# Altium schematic sheet Thermal Control.SchDoc
size A; SheetNumber: 10; SheetTotal: 16
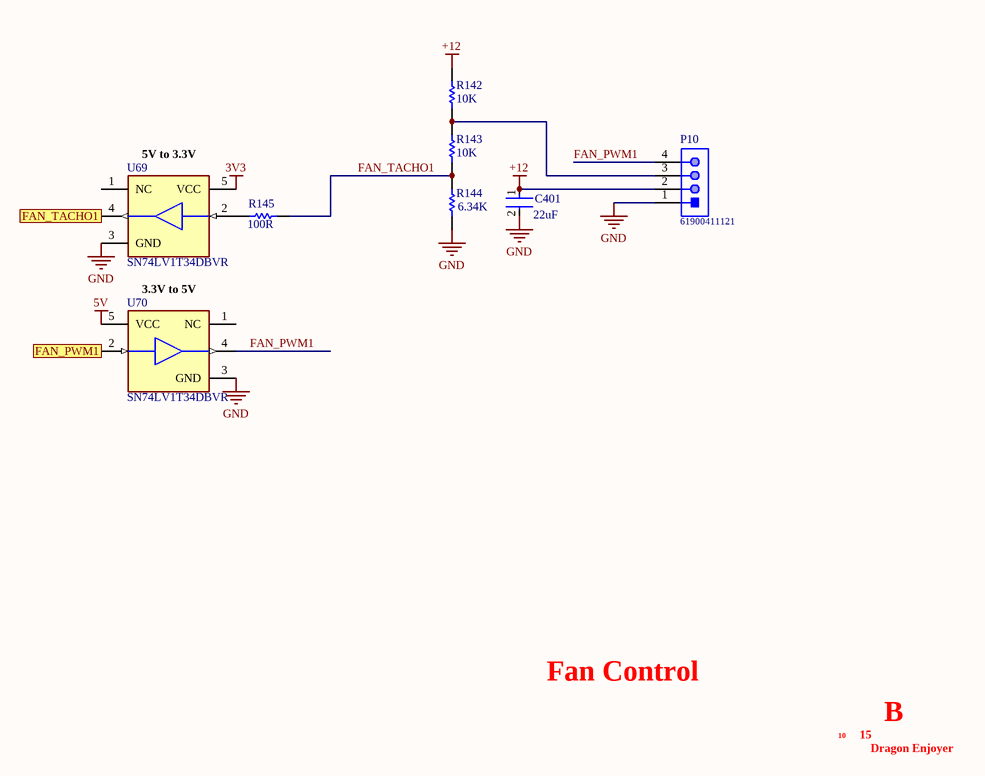
[diagram p0: Thermal Control.SchDoc]

## Parts
C401  value 22uF  [FP-CL31H-0_2-MFG]  (hidden comment: CL31A226KAHNNNE)
P10  61900411121  [61900411121]
R142  10K  [RESC1005X40X25NL05T05]
R143  10K  [RESC1005X40X25NL05T05]
R144  value 6.34K  [RESC1608X55X30ML15T15]  (hidden comment: ERJ-3EKF6341V)
R145  value 100R  [RESC1609X50X30ML8T20]  (hidden comment: CRCW0603100RFKEA)
U69  SN74LV1T34DBVR  [FP-DBV0005A-MFG]
U70  SN74LV1T34DBVR  [FP-DBV0005A-MFG]

## Ports
FAN_PWM1 (in), FAN_TACHO1 (out)

## Nets
3V3: U69.5(VCC)
5V: U70.5(VCC)
+12: C401.1 P10.2 R142.2
GND: C401.2 P10.1 R144.1 U69.3(GND) U70.3(GND)
FAN_PWM1: U70.2(A) ; port FAN_PWM1
FAN_PWM1: P10.4 U70.4(Y)  [a separate net that carries the same name]
FAN_TACHO1: U69.4(Y) ; port FAN_TACHO1
FAN_TACHO1: R143.1 R144.2 R145.2  [a separate net that carries the same name]
NetP10_3: P10.3 R142.1 R143.2
NetR145_1: R145.1 U69.2(A)

Not connected (* = marked no-connect by the designer): U69 1(NC); U70 1(NC)

## Notes on the sheet
- (near U69) 5V to 3.3V
- 3.3V to 5V
- Fan Control
- 10
- 15
- B
- Dragon Enjoyer

## Library data of the parts
C401 = CMP-13271-000012-1: CAP CER 22UF 25V X5R 1206; Manufacturer: Samsung; Temperature Coefficient: 15%; Tolerance: 10%; Material: Ceramic; Automotive: No; Device Class L3: Ceramic Capacitors; Temperature: -55°C to +85°C; Octopart: https://octopart.com/cl31a226kahnnne-samsung-19832795; Temperature Range Low: -55°C; Voltage Rating: 25V; Height: 1.8mm; Temperature Characteristic: X5R; Package: CL31H-0.2; Temperature Range High: +85°C; ComponentLink2URL: http://www.samsungsem.com/kr/support/product-search/mlcc/__icsFiles/afieldfile/2019/05/10/19-CL31A226KAHNNNE.pdf; Ipc Land Pattern Name: CAPC320160X160; Lead Free: Yes; Device Class L2: Capacitors; Device Class L1: Passive Components; Capacitance: 22uF; Digikey Description: CAP CER 22UF 25V X5R 1206; Manufacturer Part Number: CL31A226KAHNNNE; RoHS: TRUE; Category: Cap; ComponentLink2Description: Datasheet
P10 = CMP-1502-00586-1: Male Locking Header WR-WTB, THT, Vertical, pitch 2.54 mm, 1 x 4 position; Manufacturer: Wurth Elektronik; Working Voltage: 250VAC; Pitch: 2.54mm; Contact Resistance: 20mOhm; Position: 1x4; Publisher: WurthElektronik; Manufacturer URL: http://www.we-online.de; Datasheet URL: https://katalog.we-online.de/em/datasheet/6190xx11121.pdf; Operating Temperature: -40to105degC; Packaging: Bag; Gender: Male; Package Reference: 61900411121; Orientation: Vertical; Mounting Technology: THT; Part Number: 61900411121
R142 R143 = CMP-2002-08136-1: Manufacturer: Vishay Dale; Part Number: CRCW040210K0JNED
R144 = CMP-2000-00600-1: Manufacturer: Panasonic; Part Number: ERJ-3EKF6341V
R145 = CMP-2000-03824-5: Chip Resistor, 100 Ohm, +/- 1%, 100 mW,-55 to 155 degC, 0603 (1608 Metric), RoHS, Tape and Ree; Manufacturer: Vishay Semiconductor; ComponentLink2URL: http://www.vishay.com/docs/20035/dcrcwe3.pdf; ComponentLink1URL: http://www.vishay.com/; Mounting Technology: Surface Mount; ComponentLink1Description: Manufacturer URL; ComponentLink2Description: Datasheet; PackageDescription: 2-Pin Surface Mount Device, Body 1.575 x 0.85 mm; PackageReference: 0603; DatasheetVersion: 06/2012
U69 U70 = CMP-016-00010-1: IC BUFFER GATE SGL CMOS SOT23-5